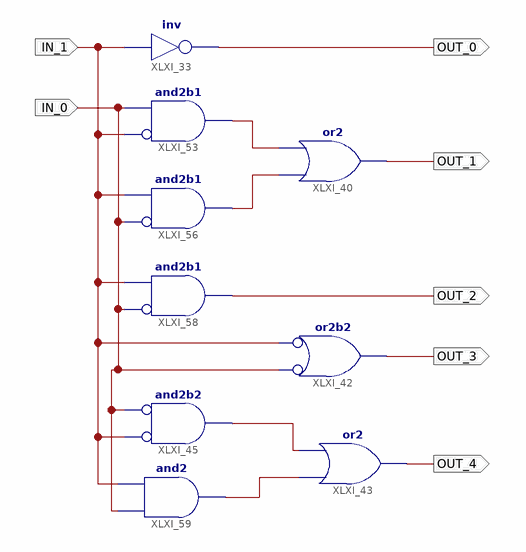
[diagram p0: schematic sheet 1]
// Xilinx ISE schematic My2To4Decoder.sch (spartan3a) as structural Verilog: 9 symbols, 7 ports
module My2To4Decoder (
  input  IN_0,
  input  IN_1,
  output OUT_0,
  output OUT_1,
  output OUT_3,
  output OUT_4,
  output OUT_2
);

  wire XLXN_64, XLXN_75, XLXN_76, XLXN_77;

  or XLXI_42 (OUT_3, ~IN_0, ~IN_1);  // or2b2
  not XLXI_33 (OUT_0, IN_1);
  and XLXI_53 (XLXN_75, ~IN_1, IN_0);  // and2b1
  and XLXI_56 (XLXN_76, ~IN_0, IN_1);  // and2b1
  or XLXI_40 (OUT_1, XLXN_76, XLXN_75);
  and XLXI_58 (OUT_2, ~IN_0, IN_1);  // and2b1
  or XLXI_43 (OUT_4, XLXN_77, XLXN_64);
  and XLXI_45 (XLXN_64, ~IN_1, ~IN_0);  // and2b2
  and XLXI_59 (XLXN_77, IN_0, IN_1);
endmodule
